# EAGLE design brewBuddy (EAGLE 9.3.0)
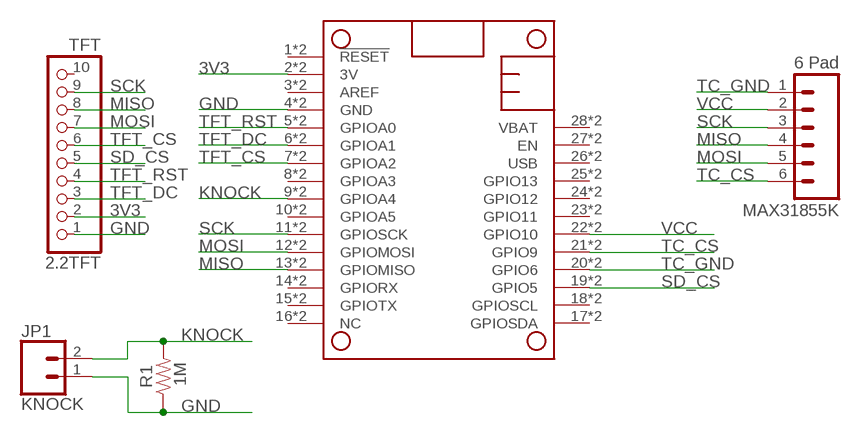
[diagram p0: schematic, sheet 1]

## Parts
2.2TFT  TFT  MICROBUILDER_HEADER-1X101X10_2MM  [MICROBUILDER_1X10_ROUND_2MM]
JP1  KNOCK  CONN_025MM  [SCREWTERMINAL-5MM-2]
MAX31855K  6 Pad  M06LONGPADS  [1X06_LONGPADS]
MS1  FEATHERWING_SMTDUAL  [FEATHERWING_SMT2]
R1  1M  RESISTOR0805  [0805]

## Nets
3V3: 2.2TFT.2 MS1.2'(3V) MS1.2(3V)
GND: 2.2TFT.1 JP1.1 MS1.4'(GND) MS1.4(GND) R1.1
KNOCK: JP1.2 MS1.9'(GPIOA4) MS1.9(GPIOA4) R1.2
MISO: 2.2TFT.8 MAX31855K.4 MS1.13'(GPIOMISO) MS1.13(GPIOMISO)
MOSI: 2.2TFT.7 MAX31855K.5 MS1.12'(GPIOMOSI) MS1.12(GPIOMOSI)
SCK: 2.2TFT.9 MAX31855K.3 MS1.11'(GPIOSCK) MS1.11(GPIOSCK)
SD_CS: 2.2TFT.5 MS1.19'(GPIO5) MS1.19(GPIO5)
TC_CS: MAX31855K.6 MS1.21'(GPIO9) MS1.21(GPIO9)
TC_GND: MAX31855K.1 MS1.20'(GPIO6) MS1.20(GPIO6)
TFT_CS: 2.2TFT.6 MS1.7'(GPIOA2) MS1.7(GPIOA2)
TFT_DC: 2.2TFT.3 MS1.6'(GPIOA1) MS1.6(GPIOA1)
TFT_RST: 2.2TFT.4 MS1.5'(GPIOA0) MS1.5(GPIOA0)
VCC: MAX31855K.2 MS1.22'(GPIO10) MS1.22(GPIO10)
Unconnected: 2.2TFT.10 MS1.1'(!RESET) MS1.1(!RESET) MS1.3'(AREF) MS1.3(AREF) MS1.8'(GPIOA3) MS1.8(GPIOA3) MS1.10'(GPIOA5) MS1.10(GPIOA5) MS1.14'(GPIORX) MS1.14(GPIORX) MS1.15'(GPIOTX) MS1.15(GPIOTX) MS1.16'(NC) MS1.16(NC) MS1.17'(GPIOSDA) MS1.17(GPIOSDA) MS1.18'(GPIOSCL) MS1.18(GPIOSCL) MS1.23'(GPIO11) MS1.23(GPIO11) MS1.24'(GPIO12) MS1.24(GPIO12) MS1.25'(GPIO13) MS1.25(GPIO13) MS1.26'(USB) MS1.26(USB) MS1.27'(EN) MS1.27(EN) MS1.28'(VBAT) MS1.28(VBAT)

## Library data of the parts
2.2TFT = Adafruit_2.2_SPI_240x320:MICROBUILDER_HEADER-1X10: PIN HEADER
JP1 = SparkFun-Connectors:CONN_02: Multi connection point. Often used as Generic Header-pin footprint for 0.1 inch spaced/style header connections On any of the 0.1 inch spaced packages, you can populate with these: Break Away Headers - Straight <https://www.sparkfun.com/products/116> (PRT-00116) Break Away Male Headers - Right Angle <https://www.sparkfun.com/products/553> (PRT-00553) Female Headers <https://www.sparkfun.com/products/115> (PRT-00115) Break Away Headers - Machine Pin <https://www.sparkfun.com/products/117> (PRT-00117) Break Away Female Headers - Swiss Machine Pin <https://www.sparkfun.com/products/743> (PRT-00743) For SCREWTERMINALS and SPRING TERMINALS visit here: Screw Terimnals on SparkFun.com <https://www.sparkfun.com/search/results?term=Screw+Terminals> (5mm/3.5mm/2.54mm spacing) This device is also useful as a general connection point to wire up your design to another part of your project. Our various solder wires solder well into these plated through hole pads. Hook-Up Wire - Assortment (Stranded, 22 AWG) <https://www.sparkfun.com/products/11375> (PRT-11375) Hook-Up Wire - Assortment (Solid Core, 22 AWG) <https://www.sparkfun.com/products/11367> (PRT-11367) View the entire wire category on our website here <https://www.sparkfun.com/categories/141> Special notes: Molex polarized connector foot print use with: PRT-08233 with associated crimp pins and housings. 2.54_SCREWTERM for use with PRT-10571. 3.5mm Screw Terminal footprints for PRT-08084 5mm Screw Terminal footprints for use with PRT-08432; SF_SKU: PRT-08432
MAX31855K = SparkFun_Thermocouple_Breakout:M06: Header 6 Standard 6-pin 0.1" header. Use with straight break away headers (SKU : PRT-00116), right angle break away headers (PRT-00553), swiss pins (PRT-00743), machine pins (PRT-00117), and female headers (PRT-00115). Molex polarized connector foot print use with SKU : PRT-08094 with associated crimp pins and housings. NOTES ON THE VARIANTS LOCK and LOCK_LONGPADS... This footprint was designed to help hold the alignment of a through-hole component (i.e. 6-pin header) while soldering it into place. You may notice that each hole has been shifted either up or down by 0.005 of an inch from it's more standard position (which is a perfectly straight line). This slight alteration caused the pins (the squares in the middle) to touch the edges of the holes. Because they are alternating, it causes a "brace" to hold the component in place. 0.005 has proven to be the perfect amount of "off-center" position when using our standard breakaway headers. Although looks a little odd when you look at the bare footprint, once you have a header in there, the alteration is very hard to notice. Also,if you push a header all the way into place, it is covered up entirely on the bottom side. This idea of altering the position of holes to aid alignment will be further integrated into the Sparkfun Library for other footprints. It can help hold any component with 3 or more connection pins.
MS1 = Particle-Mesh:FEATHERWING
R1 = SparkFun-Resistors:RESISTOR: Generic Resistor Package

## Board
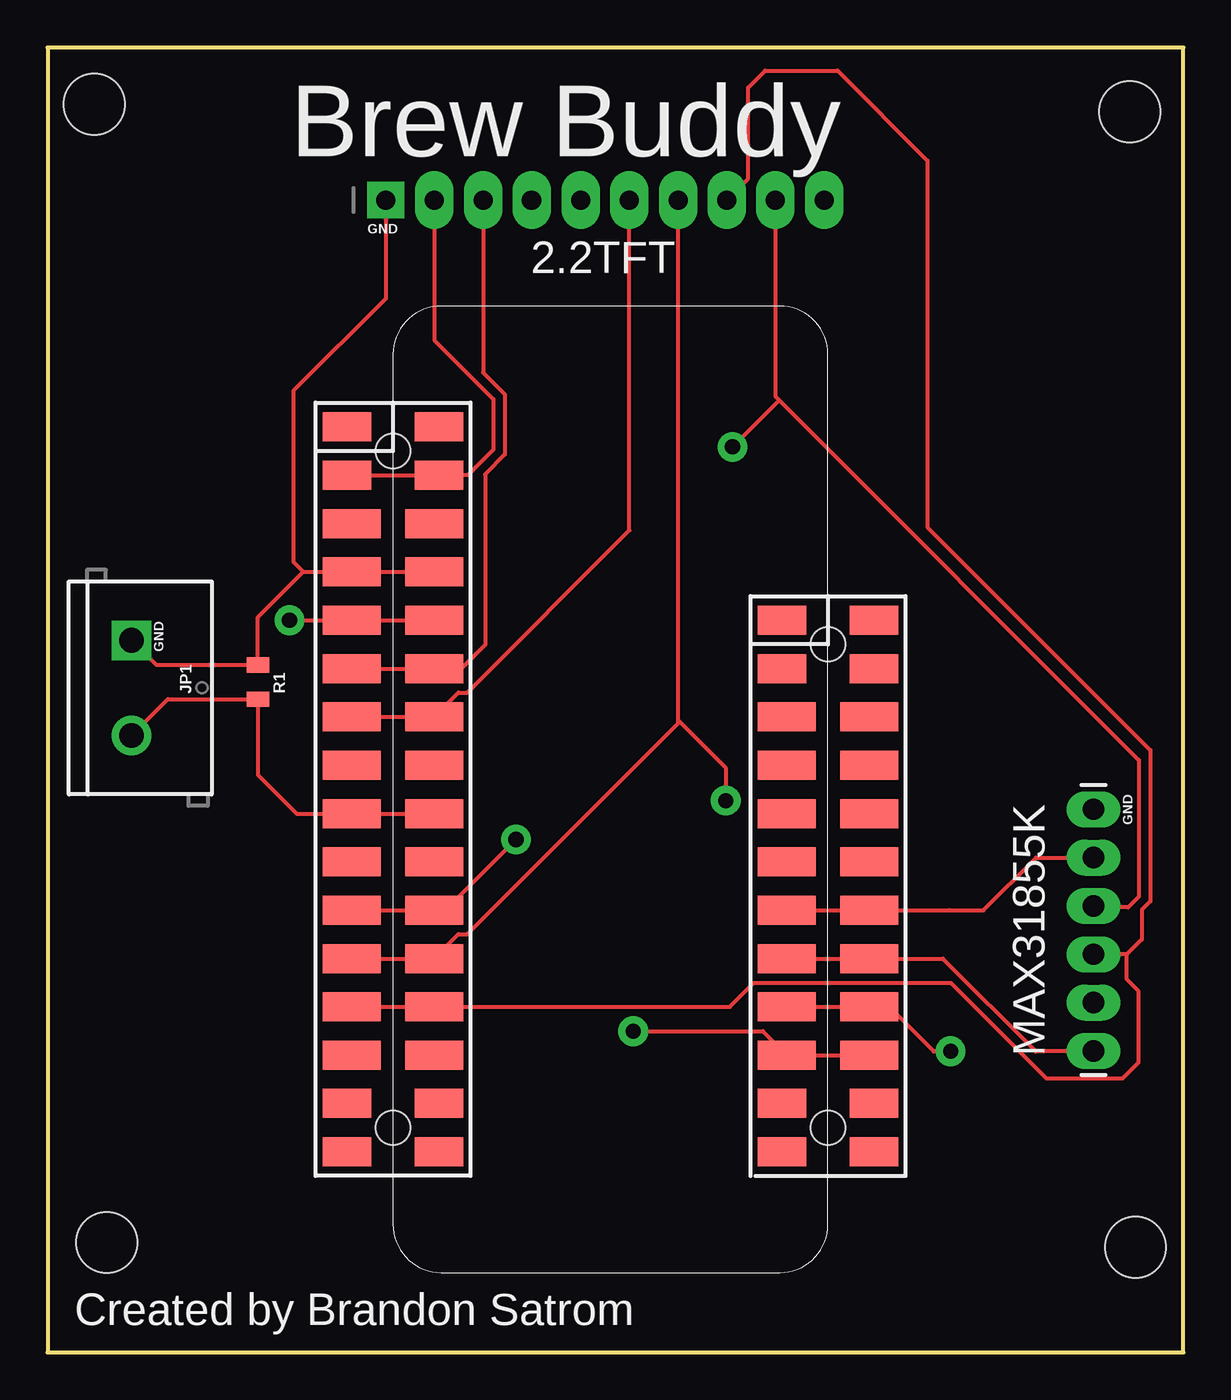
[diagram p1: board, top side]
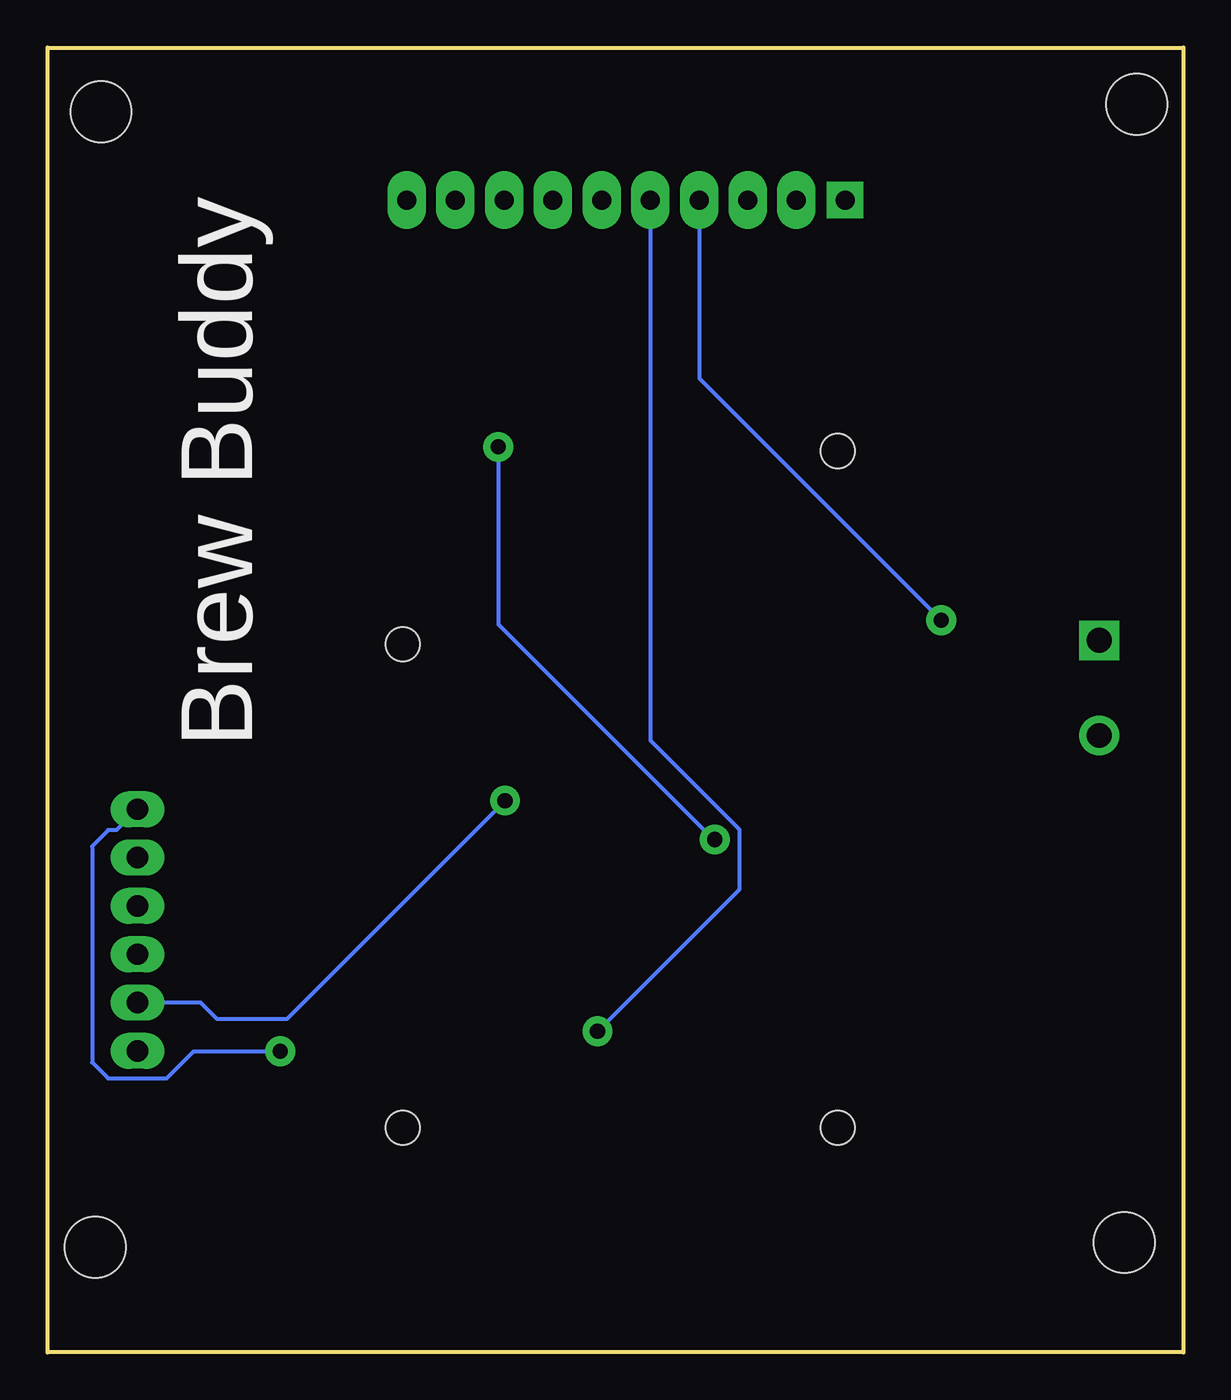
[diagram p2: board, bottom side, seen from below]

Size 59.69 x 68.58 mm. Coordinates in mm from the lower left corner, seen from the top.
Outline: 0,68.58 0,0 59.69,0 59.69,68.58 0,68.58
Copper layers (1*16): Top 0.035mm / dielectric 1.5mm / Bottom 0.035mm
Design rules "Othermill-DRC-1-64 *": minimum track width 8mil, minimum drill 0.8mm, track to track 0.39878125mm, track to pad 0.39878125mm, pad to pad 0.39878125mm, via to via 0.39878125mm, smd to smd 0mil, copper to edge 0mil, drill to drill 1mil, minimum pad ring 15mil, minimum via ring 15mil, stop-mask expansion 1mil, vias tented up to drill 30mil, thermal gap 10mil
Holes 3.2 mm at 57.18,5.52 56.88,65.21 3.11,5.78 2.45,65.6

### Footprints (pad centres in the part's own frame; a part is rotated, then mirrored left to right if it is on the bottom)
MICROBUILDER_1X10_ROUND_2MM = drill 1 pad 1.93 square: 1 -10,0 | drill 1 pad 2.032 long: 2 -7.44,0; 3 -4.88,0; 4 -2.34,0; 5 0.24,0; 6 2.8,0; 7 5.36,0; 8 7.92,0; 9 10.48,0; 10 13.04,0
SCREWTERMINAL-5MM-2 = drill 1.3 pad 2.032 square: 1 0,0 | drill 1.3 pad 2.032: 2 5,0
1X06_LONGPADS = drill 1.118 pad 1.88 long: 1 0,0; 2 2.54,0; 3 5.08,0; 4 7.62,0; 5 10.16,0; 6 12.7,0
FEATHERWING_SMT2 = smd 1.524 x 2.54: 1 6.35,2.413; 1' 6.35,-2.413; 2 8.89,2.413; 2' 8.89,-2.413; 15 41.91,2.413; 15' 41.91,-2.413; 16 44.45,2.413; 16' 44.45,-2.413; 17 44.45,20.447; 17' 44.45,25.273; 18 41.91,20.447; 18' 41.91,25.273; 27 19.05,20.447; 27' 19.05,25.273; 28 16.51,20.447; 28' 16.51,25.273 | smd 1.524 x 3.048: 3 11.43,2.159; 3' 11.43,-2.159; 4 13.97,2.159; 4' 13.97,-2.159; 5 16.51,2.159; 5' 16.51,-2.159; 6 19.05,2.159; 6' 19.05,-2.159; 7 21.59,2.159; 7' 21.59,-2.159; 8 24.13,2.159; 8' 24.13,-2.159; 9 26.67,2.159; 9' 26.67,-2.159; 10 29.21,2.159; 10' 29.21,-2.159; 11 31.75,2.159; 11' 31.75,-2.159; 12 34.29,2.159; 12' 34.29,-2.159; 13 36.83,2.159; 13' 36.83,-2.159; 14 39.37,2.159; 14' 39.37,-2.159; 19 39.37,20.701; 19' 39.37,25.019; 20 36.83,20.701; 20' 36.83,25.019; 21 34.29,20.701; 21' 34.29,25.019; 22 31.75,20.701; 22' 31.75,25.019; 23 29.21,20.701; 23' 29.21,25.019; 24 26.67,20.701; 24' 26.67,25.019; 25 24.13,20.701; 25' 24.13,25.019; 26 21.59,20.701; 26' 21.59,25.019 | hole 1.8: 17.78,22.86; 43.18,22.86; 7.62,0; 43.18,0
0805 = smd 0.8 x 1.2: 1 -0.9,0; 2 0.9,0

### Placement (x,y rotation side)
2.2TFT  27.77,60.57 0 top
JP1  4.42,37.43 270 top
MAX31855K  54.97,28.55 270 top
MS1  18.15,54.99 270 top
R1  11.06,35.23 270 top

### Tracks (layer width: path | path; a pad name or v marks a point on that pad's centre or on a via)
3V3
  Top 0.203: MS1.2' MS1.2 22.09,46.1 23.43,47.45 23.43,50.11 20.34,53.21 2.2TFT.2
GND
  Top 0.203: JP1.1 5.71,36.13 R1.1 11.06,38.63 13.45,41.02 | 13.45,41.02 MS1.4' MS1.4 | 2.2TFT.1 17.78,55.38 12.93,50.53 12.93,41.55 13.45,41.02
KNOCK
  Top 0.203: JP1.2 6.32,34.33 R1.2 11.06,30.35 13.08,28.33 13.08,28.32 MS1.9' MS1.9
MISO
  Top 0.203: MS1.13' MS1.13 35.86,18.16 37.12,19.43 47.48,19.43 52.5,14.41 56.51,14.41 57.35,15.25 57.35,18.98 56.72,19.61 56.72,20.93 | 2.2TFT.8 36.82,61.69 36.82,66.47 37.71,67.36 41.53,67.36 46.25,62.64 46.25,43.38 57.96,31.66 57.96,23.71 57.51,23.25 57.51,21.71 56.72,20.93 | 56.72,20.93 MAX31855K.4
MOSI  (via drill 0.8 pad 0.55)
  Top 0.203: MS1.12' MS1.12 21.59,21.98 22.04,21.98 33.13,33.07 | 33.13,33.07 33.22,33.16 35.64,30.73 v35.64,29 | 33.13,33.07 2.2TFT.7
  Bottom 0.203: MAX31855K.5 51.64,18.39 50.78,17.52 47.12,17.52 v35.64,29
SCK  (via drill 0.8 pad 0.55)
  Top 0.203: MS1.11' MS1.11 20.91,23.24 v24.62,26.96 | 2.2TFT.9 38.26,50.24 38.45,50.05 | 38.45,50.05 57.36,31.14 57.36,23.96 56.8,23.39 55.04,23.39 MAX31855K.3 | 38.45,50.05 v36,47.6 v36,47.59
  Bottom 0.203: v36,47.59 36,38.27 24.7,26.96 v24.62,26.96
SD_CS  (via drill 0.8 pad 0.55)
  Top 0.203: MS1.19' MS1.19 37.6,16.88 v30.78,16.88
  Bottom 0.203: 2.2TFT.5 28.02,32.16 23.34,27.49 23.34,24.32 v30.78,16.88
TC_CS
  Top 0.203: MS1.21 MS1.21' 47.05,20.7 51.93,15.82 51.96,15.85 MAX31855K.6
TC_GND  (via drill 0.8 pad 0.55)
  Top 0.203: MS1.20 MS1.20' 44.23,18.16 46.57,15.83 v47.46,15.83
  Bottom 0.203: MAX31855K.1 56.07,27.45 56.51,27.45 57.35,26.6 57.35,15.25 56.51,14.41 53.43,14.41 52.01,15.83 v47.46,15.83 | v47.46,15.83 47.48,15.85 47.51,15.85 47.48,15.83 v47.46,15.83
TFT_CS
  Top 0.203: MS1.7' MS1.7 21.59,34.68 22.04,34.68 30.58,43.21 2.2TFT.6
TFT_DC
  Top 0.203: MS1.6' MS1.6 21.75,35.94 22.99,37.18 22.99,46.15 24.04,47.2 24.04,50.36 22.89,51.5 2.2TFT.3
TFT_RST  (via drill 0.8 pad 0.55)
  Top 0.203: MS1.5' 16.06,38.48 | 16.06,38.48 MS1.5 | v12.71,38.48 16.05,38.48 16.06,38.48
  Bottom 0.203: 2.2TFT.4 25.44,51.2 v12.71,38.48
VCC
  Top 0.203: MS1.22 MS1.22' 47.4,23.24 47.41,23.24 49.18,23.24 51.95,26 MAX31855K.2

### Text on the board
tPlace: Brew Buddy | GND | GND | GND | Created by Brandon Satrom
bPlace: Brew Buddy